# EAGLE design USBC-OVC_LIMIT (EAGLE 9.6.2)
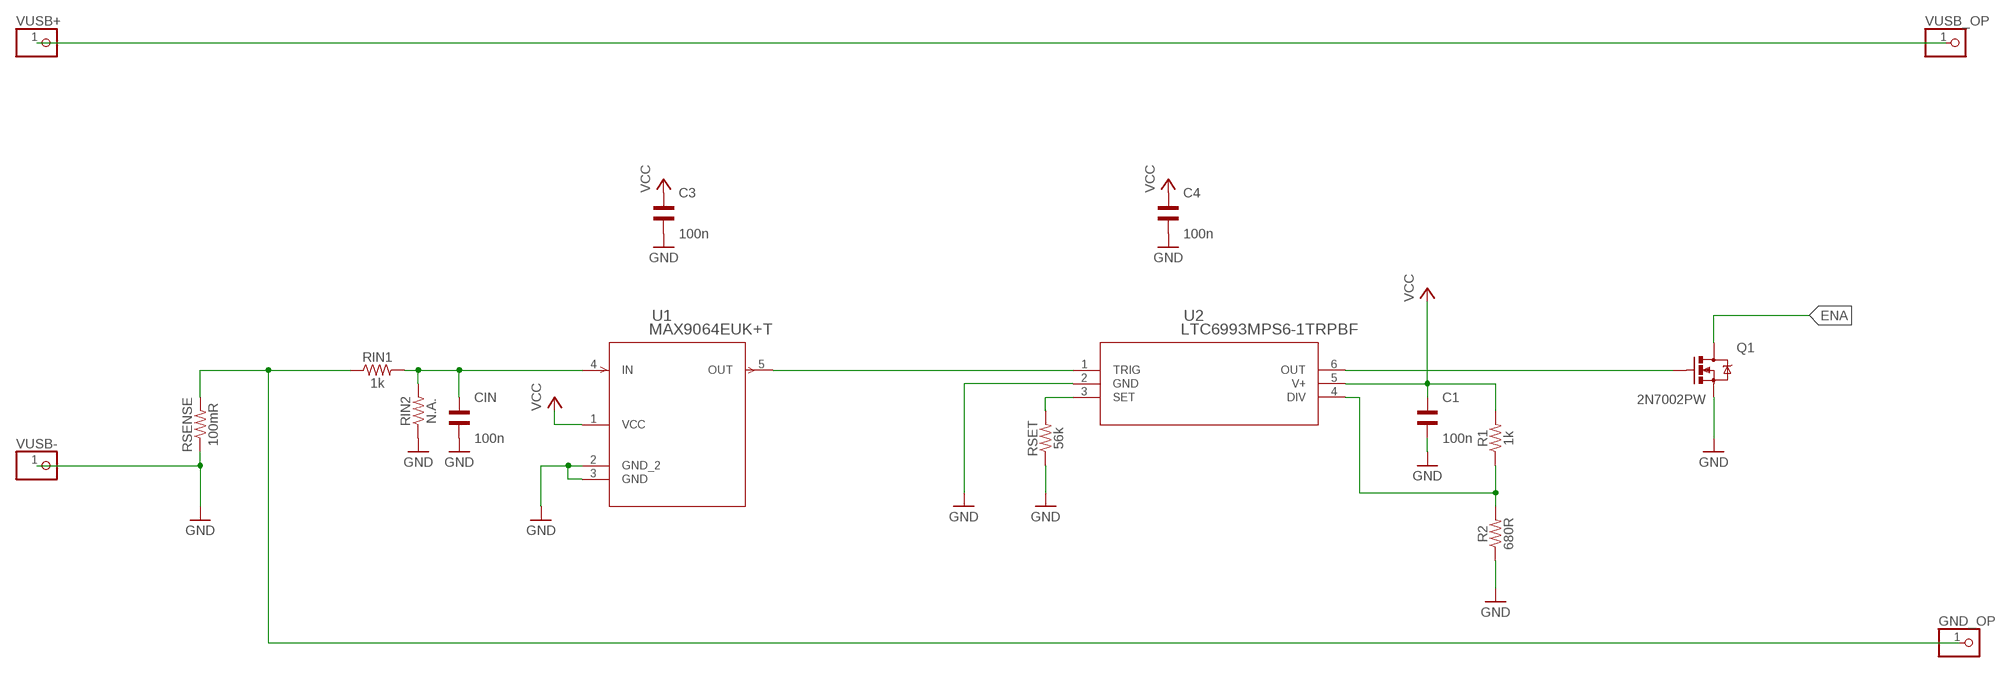
[diagram p0: schematic, sheet 1]

## Parts
C1  100n  WCAP-CSGP_1206_885012008001  [WCAP-CSGP_1206]
C3  100n  WCAP-CSGP_1206_885012008001  [WCAP-CSGP_1206]
C4  100n  WCAP-CSGP_1206_885012008001  [WCAP-CSGP_1206]
CIN  100n  WCAP-CSGP_1206_885012008001  [WCAP-CSGP_1206]
GND_OP  PINHD-1X1  [1X01]
Q1  2N7002PW  MOSFET-NCHANNEL2N7002PW  [SOT323]
R1  1k  RESISTOR1206  [1206]
R2  680R  RESISTOR1206  [1206]
RIN1  1k  RESISTOR1206  [1206]
RIN2  N.A.  RESISTOR1206  [1206]
RSENSE  100mR  RESISTOR1206  [1206]
RSET  56k  RESISTOR1206  [1206]
U1  MAX9064EUK+T  [21-0057F_MXM]
U2  LTC6993MPS6-1TRPBF  [TSOT-23_S6_LIT]
VUSB+  PINHD-1X1  [1X01]
VUSB-  PINHD-1X1  [1X01]
VUSB_OP  PINHD-1X1  [1X01]

## Nets
ENA: Q1.3(D)
GND: C1.1 C3.1 C4.1 CIN.1 Q1.2(S) R2.1 RIN2.1 RSENSE.1 RSET.1 U1.2(GND_2) U1.3(GND) U2.2(GND) VUSB-.1
GND_OP: GND_OP.1 RIN1.1 RSENSE.2
N$1: RSET.2 U2.3(SET)
N$2: CIN.2 RIN1.2 RIN2.2 U1.4(IN)
N$4: R1.1 R2.2 U2.4(DIV)
N$5: Q1.1(G) U2.6(OUT)
N$7: U1.5(OUT) U2.1(TRIG)
VCC: C1.2 C3.2 C4.2 R1.2 U1.1(VCC) U2.5(V+)
VUSB_OP: VUSB+.1 VUSB_OP.1

## Library data of the parts
C1 C3 C4 CIN = Wurth_Elektronik_Passive_Capacitors_rev19a:WCAP-CSGP_1206: WCAP-CSGP Ceramic Capacitors Characteristics Multilayer Ceramic Chip Capacitor Recommended soldering:Reflow, for 0603 and 0805 wave soldering is also allowed Operating temperature:-55 °C to +125 °C; Ceramic characteristics: Class I - NPO ; Class II -X7R, X5R High performance ceramic High capacitance stability Minimal aging Termination:Cu/Ni/Sn <http://katalog.we-online.de/media/images/eisos/WCAP-CSGP_pf2.jpg> Details see: http://katalog.we-online.de/en/pbs/WCAP-CSGP-1206? Created: 2015-01-28 2015 (C) Wurth Elektronik
GND_OP VUSB+ VUSB- VUSB_OP = Connector:PINHD-1X1: PIN HEADER; CATEGORY: CONNECTOR; SUB-CATEGORY: PIN-HEADER
Q1 = SparkFun-DiscreteSemi:MOSFET-NCHANNEL: Common NMOSFET Parts MFG P/N Store ID Prod ID FDD8780 TRANS-09984 SI7820DN TRANS-11055 FDS6630A IC-08089 2N7002PW TRANS-11151 FQP30N06L COM-10213 TRANS-10060 BSS123LT1G TRANS-08345 BSS138 TRANS-00830 BS170 2N7000; PROD_ID: TRANS-11151
R1 R2 RIN1 RIN2 RSENSE RSET = SparkFun-Resistors:RESISTOR: Generic Resistor Package
U1 = MAX9064:MAX9064EUK+T; COPYRIGHT: Copyright (C) 2022 Ultra Librarian. All rights reserved.; DIGI-KEY_PART_NUMBER_1: MAX9064EUK+TCT-ND; DIGI-KEY_PART_NUMBER_2: MAX9064EUK+TDKR-ND; DIGI-KEY_PART_NUMBER_3: MAX9064EUK+TTR-ND; MANUFACTURER_PART_NUMBER: MAX9064EUK+T; MFR_NAME: Maxim Integrated Products
U2 = LTC6993:LTC6993MPS6-1TRPBF; COPYRIGHT: Copyright (C) 2022 Ultra Librarian. All rights reserved.; DIGI-KEY_PART_NUMBER_1: LTC6993MPS6-1#TRPBF-ND; DIGI-KEY_PART_NUMBER_2: 161-LTC6993MPS6-1#TRPBFCT-ND; DIGI-KEY_PART_NUMBER_3: 161-LTC6993MPS6-1#TRPBFDKR-ND; DIGI-KEY_PART_NUMBER_4: 161-LTC6993MPS6-1#TRPBFTR-ND; MANUFACTURER_PART_NUMBER: LTC6993MPS6-1#TRPBF; MFR_NAME: Analog Devices / Linear Technology

## Board
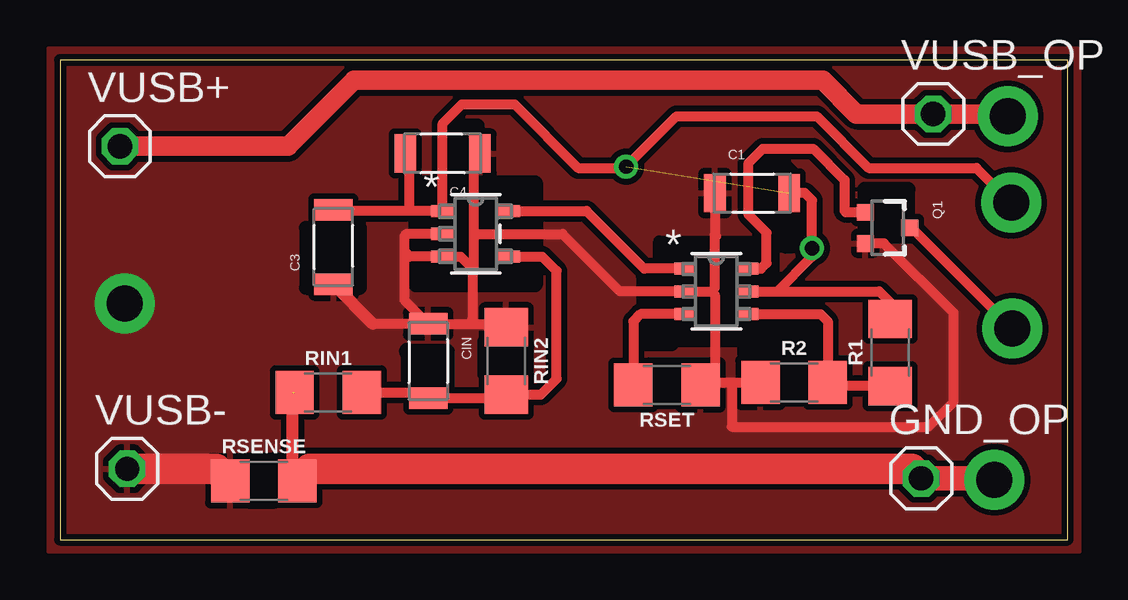
[diagram p1: board, top side]

Size 42 x 20 mm. Coordinates in mm from the lower left corner, seen from the top.
Outline: 0,0 42,0 42,20 0,20 0,0
Copper layers (1*16): Top 0.035mm / dielectric 1.5mm / Bottom 0.035mm
Design rules "default *": minimum track width 6mil, minimum drill 0.35mm, track to track 6mil, track to pad 6mil, pad to pad 6mil, via to via 6mil, smd to smd 6mil, copper to edge 10mil, drill to drill 6mil, minimum pad ring 10mil, minimum via ring 8mil, stop-mask expansion 4mil, vias tented up to drill 0mil, thermal gap 10mil
tRestrict: area 28.5,5.8 to 31.5,9.5; area 24.3,8.2 to 25.5,11; area 24.5,5.8 to 27,7.3; area 10.2,10.5 to 12.5,13; area 33.5,12.6 to 35.4,14.6; area 29.2,12.2 to 30.6,15.6; area 16.4,15.6 to 17.4,17.3; area 14.4,6.1 to 16.1,7.9; area 17.7,6.8 to 19.4,8.2; area 7.8,1.6 to 9.1,3.3

### Footprints (pad centres in the part's own frame; a part is rotated, then mirrored left to right if it is on the bottom)
WCAP-CSGP_1206 = smd 0.9 x 1.6: 1 -1.55,0; 2 1.55,0
1X01 = drill 1.016 octagon: 1 0,0
SOT323 = smd 0.7 x 0.7: 1 -0.65,-0.925; 2 0.65,-0.925; 3 0,0.925
1206 = smd 1.6 x 1.8: 1 -1.4,0; 2 1.4,0
21-0057F_MXM = smd 0.978 x 0.508: 1 -1.365,0.95; 2 -1.365,0; 3 -1.365,-0.95; 4 1.365,-0.95; 5 1.365,0.95
TSOT-23_S6_LIT = smd 0.876 x 0.508: 1 -1.314,0.95; 2 -1.314,0; 3 -1.314,-0.95; 4 1.314,-0.95; 5 1.314,0; 6 1.314,0.95

### Placement (x,y rotation side)
C1  28.85,14.45 0 top
C3  11.4,12.2 90 top
C4  15.95,16.1 180 top
CIN  15.35,7.45 270 top
GND_OP  35.9,2.55 0 top
Q1  34.5,13 270 top
R1  34.6,7.8 90 top
R2  30.6,6.55 0 top
RIN1  11.18,6.13 0 top
RIN2  18.6,7.45 270 top
RSENSE  8.5,2.45 0 top
RSET  25.3,6.45 180 top
U1  17.33,12.75 0 top
U2  27.36,10.35 0 top
VUSB+  2.5,16.4 0 top
VUSB-  2.8,2.95 0 top
VUSB_OP  36.4,17.75 0 top

### Tracks (layer width: path | path; a pad name or v marks a point on that pad's centre or on a via)
ENA  (via drill 1.5 pad 2.5)
  Top 0.406: Q1.3 35.5,13 v39.7,8.8
GND  (via drill 1.5 pad 2.5)
  Top 0.406: U1.2 14.45,12.75 14.35,12.65 14.35,12.05 | 14.35,12.05 14.56,11.84 14.56,11.8 U1.3 16.7,11.8 17.2,11.3 | 14.35,12.05 14.35,10 CIN.1 | CIN.1 17.05,9 | 17.05,9 18.45,9 RIN2.1 18.95,9.2 | CIN.1 13.05,9 | RSET.1 26.8,6.55 | 26.8,6.55 27.95,6.55 | 27.95,6.55 R2.1 | C1.1 27.3,12.7 | 27.3,12.7 27.35,12.65 | 17.2,11.3 17.2,9.15 17.05,9 | 27.15,10.35 U2.2 23.35,10.35 20.95,12.75 17.25,12.75 | 26.8,6.55 27.3,7.05 27.3,10.2 27.15,10.35 | 27.15,10.35 27.3,10.5 27.3,12.7 | 17.2,11.3 17.25,11.35 17.25,12.75 | C4.1 17.25,15.85 17.25,12.75 | 27.95,6.55 28,6.5 28,4.7 36.2,4.7 37.25,5.75 37.25,9.45 34.35,12.35 Q1.2
  Top 0.508: 13.05,9 C3.1
  Top 1.27: VUSB-.1 6.5,2.95 7,2.45 RSENSE.1
  other vias: 2.7,9.85
  pour Top (isolate 0.24): -0.5,20.5 -0.5,-0.5 42.5,-0.5 42.5,20.5
GND_OP  (via drill 1.5 pad 2.5)  (1 unrouted)
  Top 0.508: RSENSE.2 9.7,2.66 9.7,6.13
  Top 1.016: GND_OP.1 38.9,2.55 v38.95,2.5
  Top 1.27: GND_OP.1 35.5,2.95 10.4,2.95 RSENSE.2
N$1
  Top 0.406: U2.3 24.2,9.4 23.9,9.1 RSET.2
N$2
  Top 0.406: RIN1.2 15.12,6.13 CIN.2 18.45,5.9 RIN2.2 20.05,6.05 20.7,6.7 20.7,11.2 20.1,11.8 U1.4
N$4
  Top 0.406: R1.1 32.15,6.4 R2.2 32,9.1 31.7,9.4 U2.4
N$5
  Top 0.406: U2.6 29.22,11.3 29.45,11.53 29.45,12.8 28.7,13.55 28.7,15.7 29.3,16.3 31.4,16.3 32.7,15 32.7,13.7 32.75,13.65 Q1.1
N$7
  Top 0.406: U1.5 21.95,13.7 24.35,11.3 U2.1
VCC  (via drill 0.6, 1.5 pad 2.5)  (1 unrouted)
  Top 0.406: 39.7,14 v39.65,14.05 38.2,15.5 33.7,15.5 31.55,17.65 25.7,17.65 v23.6,15.55 23.55,15.5 21.6,15.5 18.95,18.15 16.75,18.15 15.95,17.35 15.95,13.71 U1.1 14.56,13.7 | C3.2 11.45,13.7 14.56,13.7 | U2.5 29.9,10.35 | 29.9,10.35 31.35,11.8 v31.35,12.15 31.35,14.15 31.05,14.45 C1.2 | 29.9,10.35 34.15,10.35 34.6,9.9 R1.2 | C4.2 14.56,15.94 14.56,13.7
VUSB_OP  (via drill 1.5 pad 2.5)
  Top 0.813: VUSB+.1 9.5,16.4 12.25,19.15 31.8,19.15 33.2,17.75 VUSB_OP.1 39.4,17.75 v39.5,17.65